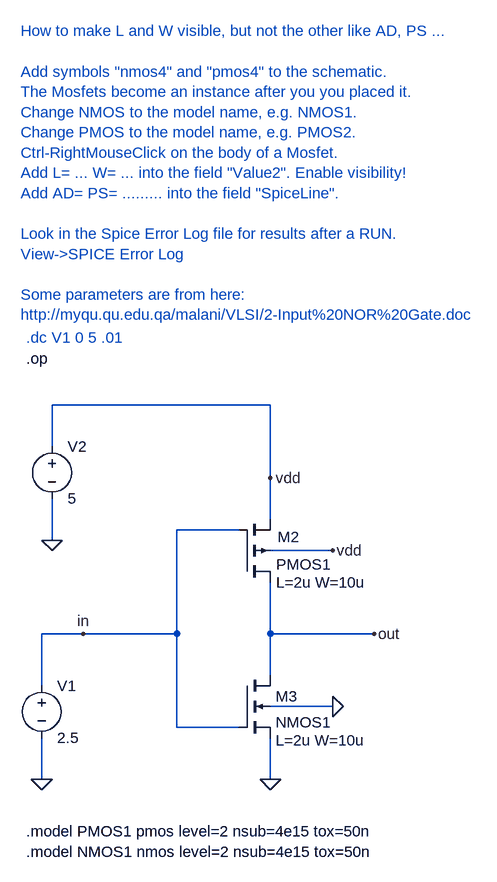
[diagram p0: schematic mos_param_visibility.asc]
mos_param_visibility.asc, the LTspice schematic file:
Version 4
SHEET 1 1404 948
WIRE 48 400 48 320
WIRE 48 544 48 480
WIRE 64 32 64 -32
WIRE 64 176 64 112
WIRE 112 320 48 320
WIRE 256 320 112 320
WIRE 256 320 256 160
WIRE 256 464 256 320
WIRE 352 160 256 160
WIRE 352 464 256 464
WIRE 400 -32 64 -32
WIRE 400 80 400 -32
WIRE 400 144 400 80
WIRE 400 320 400 240
WIRE 400 384 400 320
WIRE 400 544 400 480
WIRE 496 192 400 192
WIRE 496 432 400 432
WIRE 560 320 400 320
FLAG 112 320 in
FLAG 400 544 0
FLAG 496 432 0
FLAG 496 192 vdd
FLAG 400 80 vdd
FLAG 560 320 out
FLAG 64 176 0
FLAG 48 544 0
SYMBOL pmos4 352 240 M180
WINDOW 0 59 69 Left 0
WINDOW 3 57 27 Left 0
WINDOW 123 57 -1 Left 0
SYMATTR InstName M2
SYMATTR Value PMOS1
SYMATTR Value2 L=2u W=10u
SYMATTR SpiceLine AD=80p PD=25u AS=80p PS=25u
SYMBOL nmos4 352 384 R0
WINDOW 123 56 100 Left 0
SYMATTR InstName M3
SYMATTR Value NMOS1
SYMATTR Value2 L=2u W=10u
SYMATTR SpiceLine AD=80p PD=25u AS=80p PS=25u
SYMBOL voltage 64 16 R0
SYMATTR InstName V2
SYMATTR Value 5
SYMBOL voltage 48 384 R0
SYMATTR InstName V1
SYMATTR Value 2.5
TEXT 24 -104 Left 0 !.op
TEXT 24 624 Left 0 !.model PMOS1 pmos level=2 nsub=4e15 tox=50n\n.model NMOS1 nmos level=2 nsub=4e15 tox=50n
TEXT 24 -136 Left 0 ;.dc V1 0 5 .01
TEXT 16 -608 Left 0 ;How to make L and W visible, but not the other like AD, PS ...\n \nAdd symbols "nmos4" and "pmos4" to the schematic.\nThe Mosfets become an instance after you you placed it.\nChange NMOS to the model name, e.g. NMOS1.\nChange PMOS to the model name, e.g. PMOS2. \nCtrl-RightMouseClick on the body of a Mosfet.\nAdd L= ... W= ... into the field "Value2". Enable visibility!\nAdd AD= PS= ......... into the field "SpiceLine".\n \nLook in the Spice Error Log file for results after a RUN.\nView->SPICE Error Log\n \nSome parameters are from here:\nhttp://myqu.qu.edu.qa/malani/VLSI/2-Input%20NOR%20Gate.doc

The netlist it stands for:
* mos_param_visibility.asc
M2 out in vdd vdd PMOS1 L=2u W=10u AD=80p PD=25u AS=80p PS=25u
M3 out in 0 0 NMOS1 L=2u W=10u AD=80p PD=25u AS=80p PS=25u
V2 vdd 0 5
V1 in 0 2.5
.model NMOS NMOS
.model PMOS PMOS
.lib standard.mos
.op
.model PMOS1 pmos level=2 nsub=4e15 tox=50n
.model NMOS1 nmos level=2 nsub=4e15 tox=50n
* .dc V1 0 5 .01
* How to make L and W visible, but not the other like AD, PS ...
* Add symbols "nmos4" and "pmos4" to the schematic.
* The Mosfets become an instance after you you placed it.
* Change NMOS to the model name, e.g. NMOS1.
* Change PMOS to the model name, e.g. PMOS2.
* Ctrl-RightMouseClick on the body of a Mosfet.
* Add L= ... W= ... into the field "Value2". Enable visibility!
* Add AD= PS= ......... into the field "SpiceLine".
* Look in the Spice Error Log file for results after a RUN.
* View->SPICE Error Log
* Some parameters are from here:
* http://myqu.qu.edu.qa/malani/VLSI/2-Input%20NOR%20Gate.doc
.backanno
.end